# EAGLE design fonte (EAGLE 9.6.2)
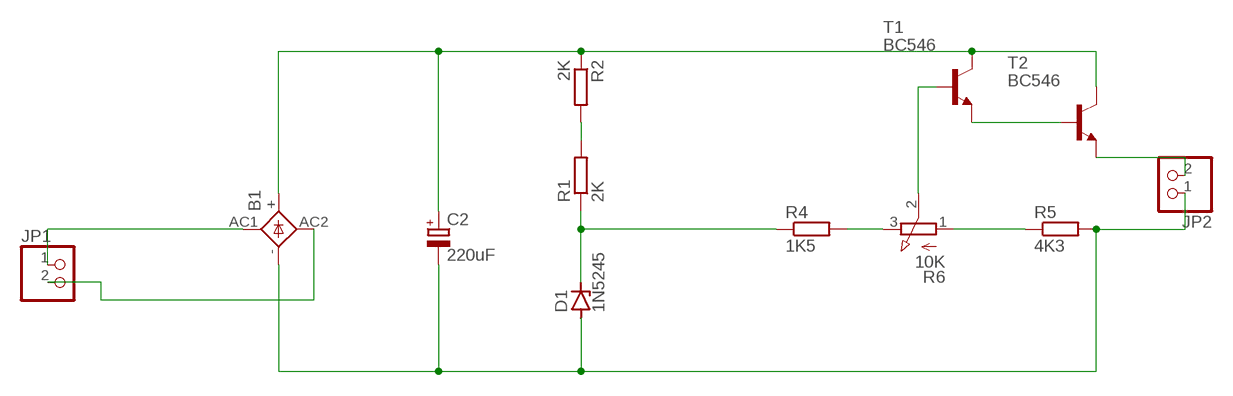
[diagram p0: schematic, sheet 1]

## Parts
B1  KBU  [KBU]
C2  220uF  CPOL-EUE3.5-10  [E3,5-10]
D1  1N5245  1N4728  [DO41Z10]
JP1  PINHD-1X2  [1X02]
JP2  PINHD-1X2  [1X02]
R1  2K  R-EU_0204/7  [0204/7]
R2  2K  R-EU_0204/7  [0204/7]
R4  1K5  R-EU_0204/7  [0204/7]
R5  4K3  R-EU_0204/7  [0204/7]
R6  10K  3RP/1610N  [3RP/1610N]
T1  BC546  BC547  [TO92]
T2  BC546  BC547  [TO92]

## Nets
N$1: R1.2 R2.2
N$2: D1.C R1.1 R4.1
N$3: T1.1(E) T2.2(B)
N$4: R4.2 R6.3(E)
N$5: R5.1 R6.1(A)
N$6: R6.2(S) T1.2(B)
N$7: B1.- C2.- D1.A JP2.1 R5.2
N$8: B1.+ C2.+ R2.1 T1.3(C) T2.3(C)
N$9: JP2.2 T2.1(E)
N$10: B1.AC2 JP1.2
N$11: B1.AC1 JP1.1

## Library data of the parts
B1 = rectifier:KBU: DIOTEC RECTIFIER
C2 = rcl:CPOL-EU: POLARIZED CAPACITOR, European symbol; SPICEPREFIX: C
D1 = diode:1N4728: Z DIODE 3.3 V, 1W, 5 percent
JP1 JP2 = pinhead:PINHD-1X2: PIN HEADER
R1 R2 R4 R5 = rcl:R-EU_: RESISTOR, European symbol; SPICEPREFIX: R
R6 = pot:3RP/1610N: 16mm Potentiometer one level Source: http://www.alphapotentiometers.net/html/16mm_pot_2.html
T1 T2 = transistor:BC547: NPN TRANSISTOR

## Board
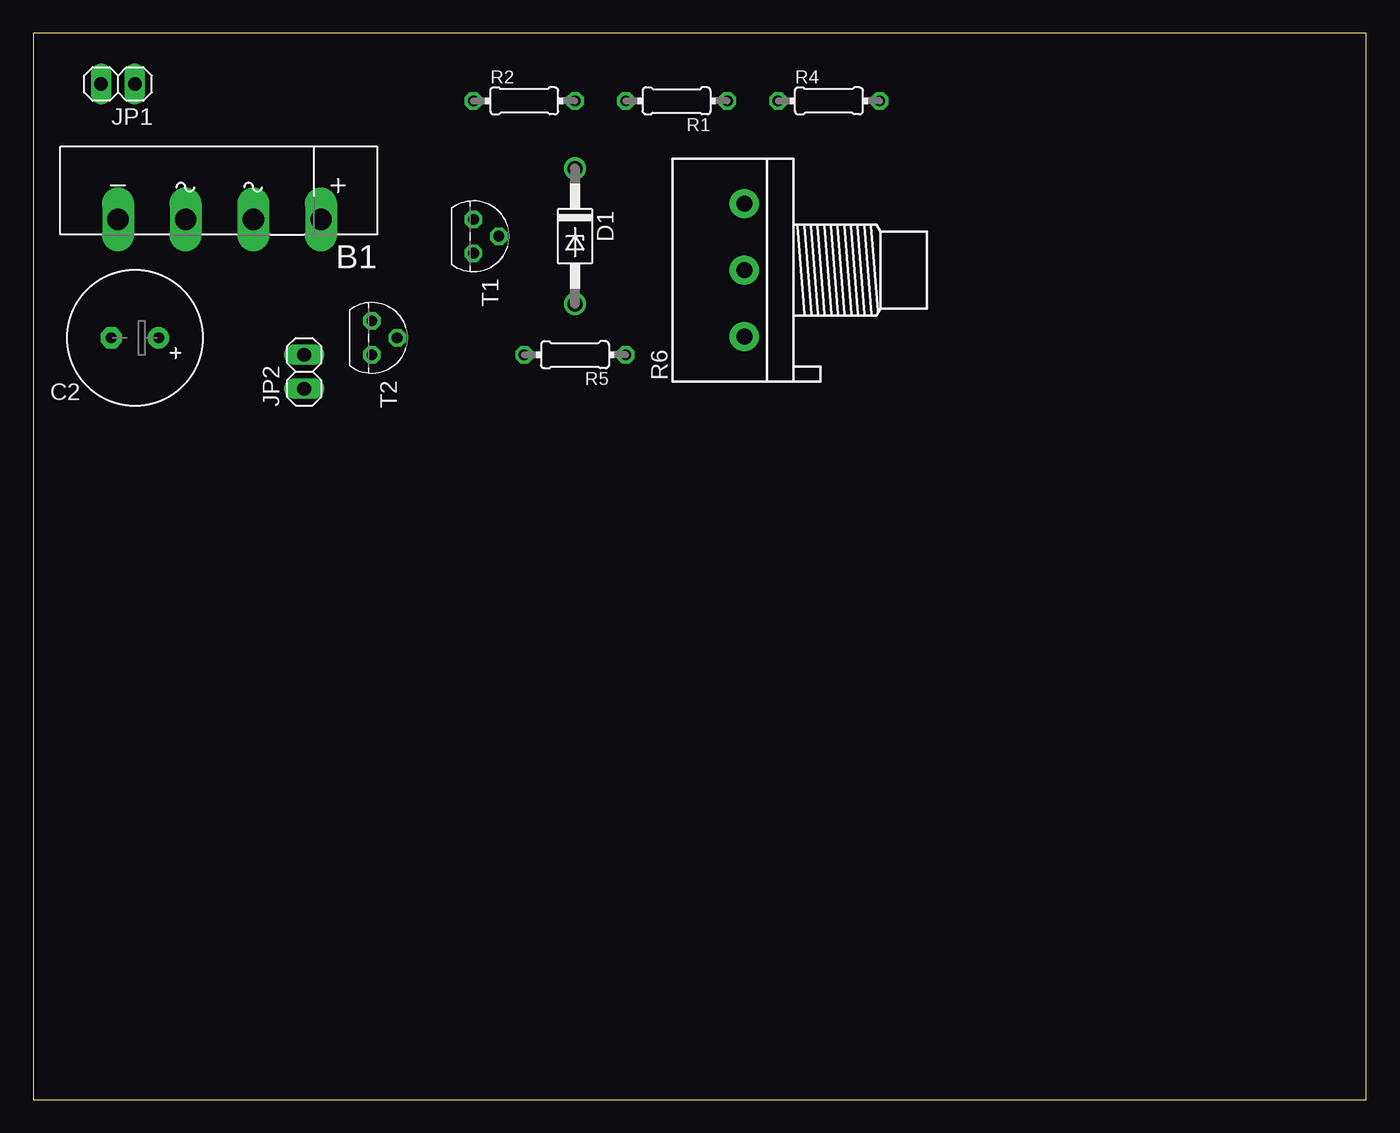
[diagram p1: board, top side]
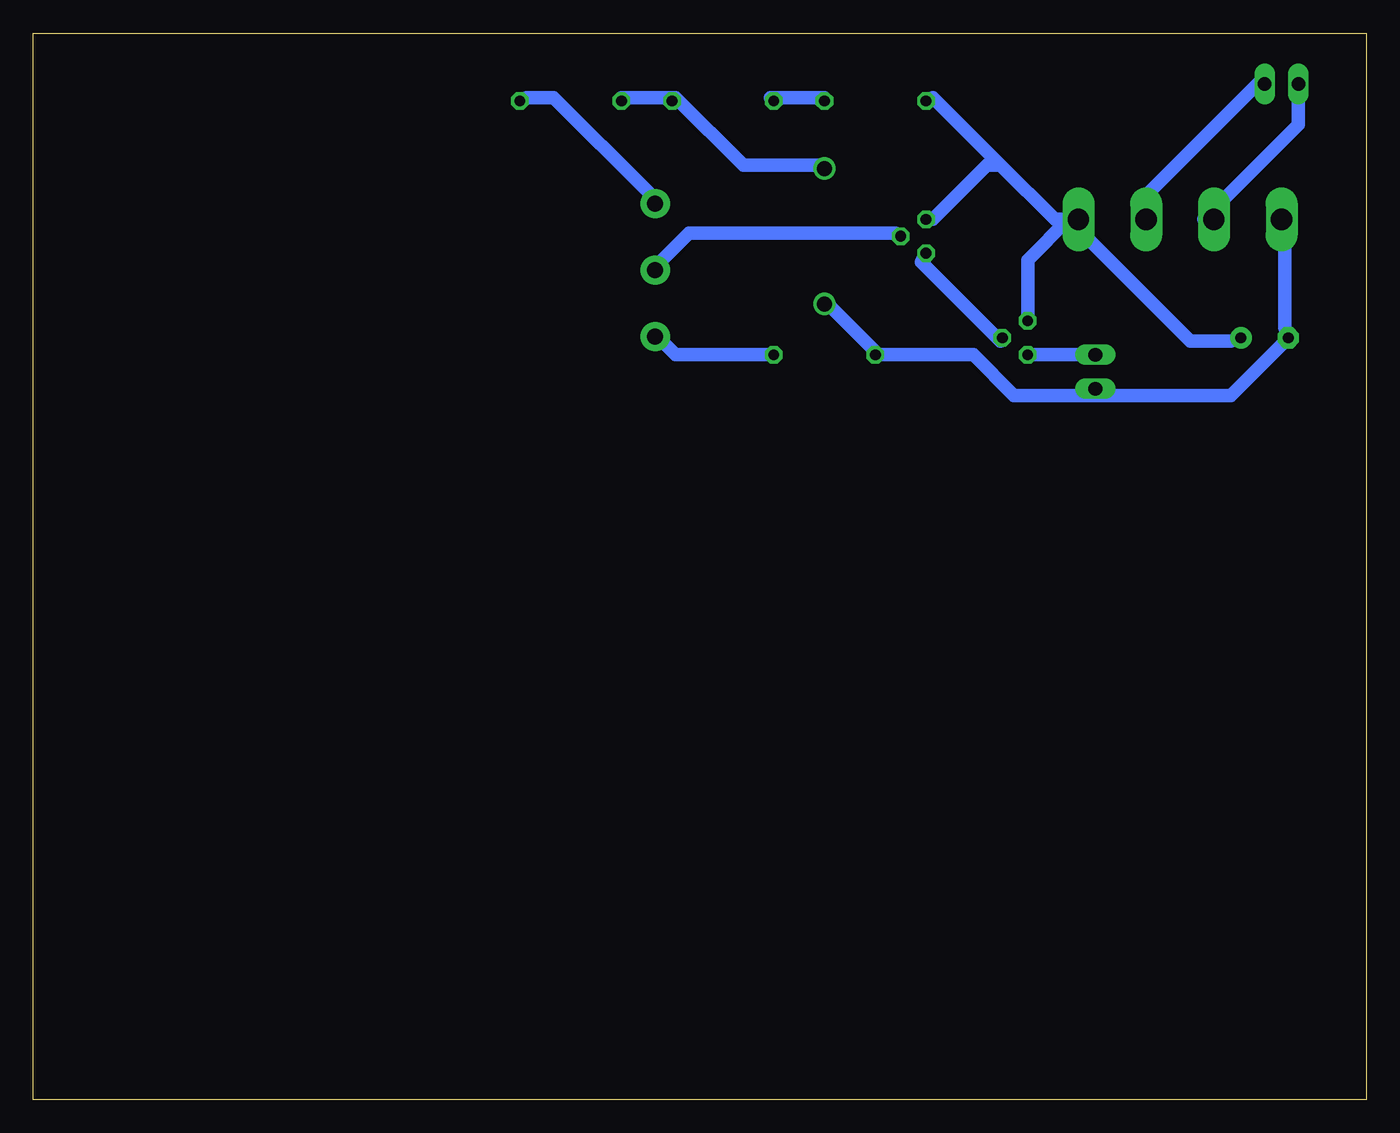
[diagram p2: board, bottom side, seen from below]

Size 100 x 80 mm. Coordinates in mm from the lower left corner, seen from the top.
Outline: 0,0 100,0 100,80 0,80 0,0
Copper layers (1*16): Top 0.035mm / dielectric 1.5mm / Bottom 0.035mm
Design rules "default *": minimum track width 40mil, minimum drill 0.35mm, track to track 40mil, track to pad 40mil, pad to pad 40mil, via to via 40mil, smd to smd 40mil, copper to edge 40mil, drill to drill 6mil, minimum pad ring 10mil, minimum via ring 8mil, stop-mask expansion 4mil, vias tented up to drill 0mil, thermal gap 10mil

### Footprints (pad centres in the part's own frame; a part is rotated, then mirrored left to right if it is on the bottom)
KBU = drill 1.6 long: + -7.62,2.54; - 7.62,2.54; AC1 -2.54,2.54; AC2 2.54,2.54
E3,5-10 = drill 0.813 pad 1.6: + -1.778,0 | drill 0.813 pad 1.6 octagon: - 1.778,0
DO41Z10 = drill 1.118: A 5.08,0; C -5.08,0
1X02 = drill 1.016 long: 1 -1.27,0; 2 1.27,0
0204/7 = drill 0.813 octagon: 1 -3.81,0; 2 3.81,0
3RP/1610N = drill 1.2 pad 2.184: 1 -5,0; 2 0,0; 3 5,0
TO92 = drill 0.813 octagon: 1 1.27,0; 2 0,1.905; 3 -1.27,0

### Placement (x,y rotation side)
B1  13.97,68.58 180 top
C2  7.62,57.15 180 top
D1  40.64,64.77 270 top
JP1  6.35,76.2 180 top
JP2  20.32,54.61 90 top
R1  48.26,74.93 180 top
R2  36.83,74.93 0 top
R4  59.69,74.93 0 top
R5  40.64,55.88 180 top
R6  53.34,62.23 90 top
T1  33.02,64.77 270 top
T2  25.4,57.15 270 top

### Tracks (layer width: path | path; a pad name or v marks a point on that pad's centre or on a via)
N$1
  Bottom 1.016: R2.2 40.64,75.18 44.7,75.18 R1.2
N$2
  Bottom 1.016: 51.82,75.18 55.88,75.18 R4.1 | 51.82,75.18 46.74,70.1 40.64,70.1 D1.C | 51.82,75.18 R1.1
N$3
  Bottom 1.016: T2.2 27.43,56.9 33.36,62.82 T1.1
N$4
  Bottom 1.016: R4.2 62.99,75.18 60.96,75.18 53.85,68.07 R6.3
N$5
  Bottom 1.016: R5.1 51.82,55.88 52.83,56.9 R6.1
N$6
  Bottom 1.016: T1.2 35.31,65.02 50.8,65.02 52.83,62.99 R6.2
N$7
  Bottom 1.016: 36.58,55.88 40.64,59.94 D1.A | 20.32,52.83 10.16,52.83 C2.- 6.1,57.91 6.1,66.04 B1.- | 36.58,55.88 29.46,55.88 26.42,52.83 20.32,52.83 | 36.58,55.88 R5.2 | 20.32,52.83 JP2.1
N$8
  Bottom 1.016: T2.3 25.4,62.99 22.35,66.04 | 27.43,70.1 23.37,66.04 22.35,66.04 | 27.43,70.1 32.51,75.18 R2.1 | 22.35,66.04 13.21,56.9 10.16,56.9 C2.+ | 22.35,66.04 B1.+ | 27.43,70.1 28.45,70.1 32.51,66.04 T1.3
N$9
  Bottom 1.016: JP2.2 T2.1
N$10
  Bottom 1.016: JP1.2 5.08,73.15 12.19,66.04 B1.AC2
N$11
  Bottom 1.016: JP1.1 8.13,76.2 16.26,68.07 16.26,66.04 B1.AC1